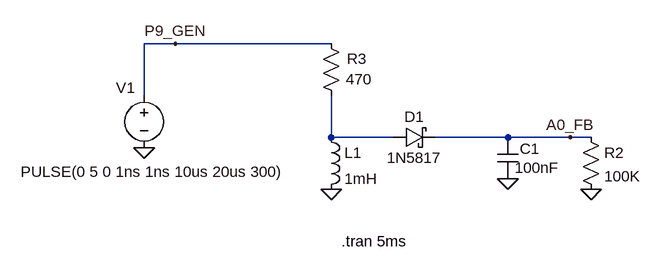
[diagram p0: schematic MetalDetector.asc]
MetalDetector.asc, the LTspice schematic file:
Version 4
SHEET 1 880 680
WIRE -64 112 -112 112
WIRE 176 112 -64 112
WIRE -112 192 -112 112
WIRE 176 256 176 192
WIRE 272 256 176 256
WIRE 448 256 336 256
WIRE 544 256 448 256
WIRE 576 256 544 256
FLAG 448 320 0
FLAG -112 272 0
FLAG 576 336 0
FLAG 176 336 0
FLAG -64 112 P9_GEN
FLAG 544 256 A0_FB
SYMBOL cap 432 256 R0
WINDOW 0 34 18 Left 2
WINDOW 3 27 47 Left 2
SYMATTR InstName C1
SYMATTR Value 100nF
SYMBOL schottky 272 272 R270
WINDOW 0 32 32 VTop 2
WINDOW 3 0 32 VBottom 2
SYMATTR InstName D1
SYMATTR Value 1N5817
SYMATTR Description Diode
SYMATTR Type diode
SYMBOL voltage -112 176 R0
WINDOW 0 -43 4 Left 2
WINDOW 3 -190 133 Left 2
WINDOW 123 0 0 Left 2
WINDOW 39 0 0 Left 2
SYMATTR InstName V1
SYMATTR Value PULSE(0 5 0 1ns 1ns 10us 20us 300)
SYMBOL res 560 240 R0
SYMATTR InstName R2
SYMATTR Value 100K
SYMBOL res 192 208 R180
WINDOW 0 -39 73 Left 2
WINDOW 3 -47 41 Left 2
SYMATTR InstName R3
SYMATTR Value 470
SYMBOL ind 160 240 R0
SYMATTR InstName L1
SYMATTR Value 1mH
TEXT 192 416 Left 2 !.tran 5ms

The netlist it stands for:
* MetalDetector.asc
C1 A0_FB 0 100nF
D1 N001 A0_FB 1N5817
V1 P9_GEN 0 PULSE(0 5 0 1ns 1ns 10us 20us 300)
R2 A0_FB 0 100K
R3 N001 P9_GEN 470
L1 N001 0 1mH
.model D D
.lib standard.dio
.tran 5ms
.backanno
.end